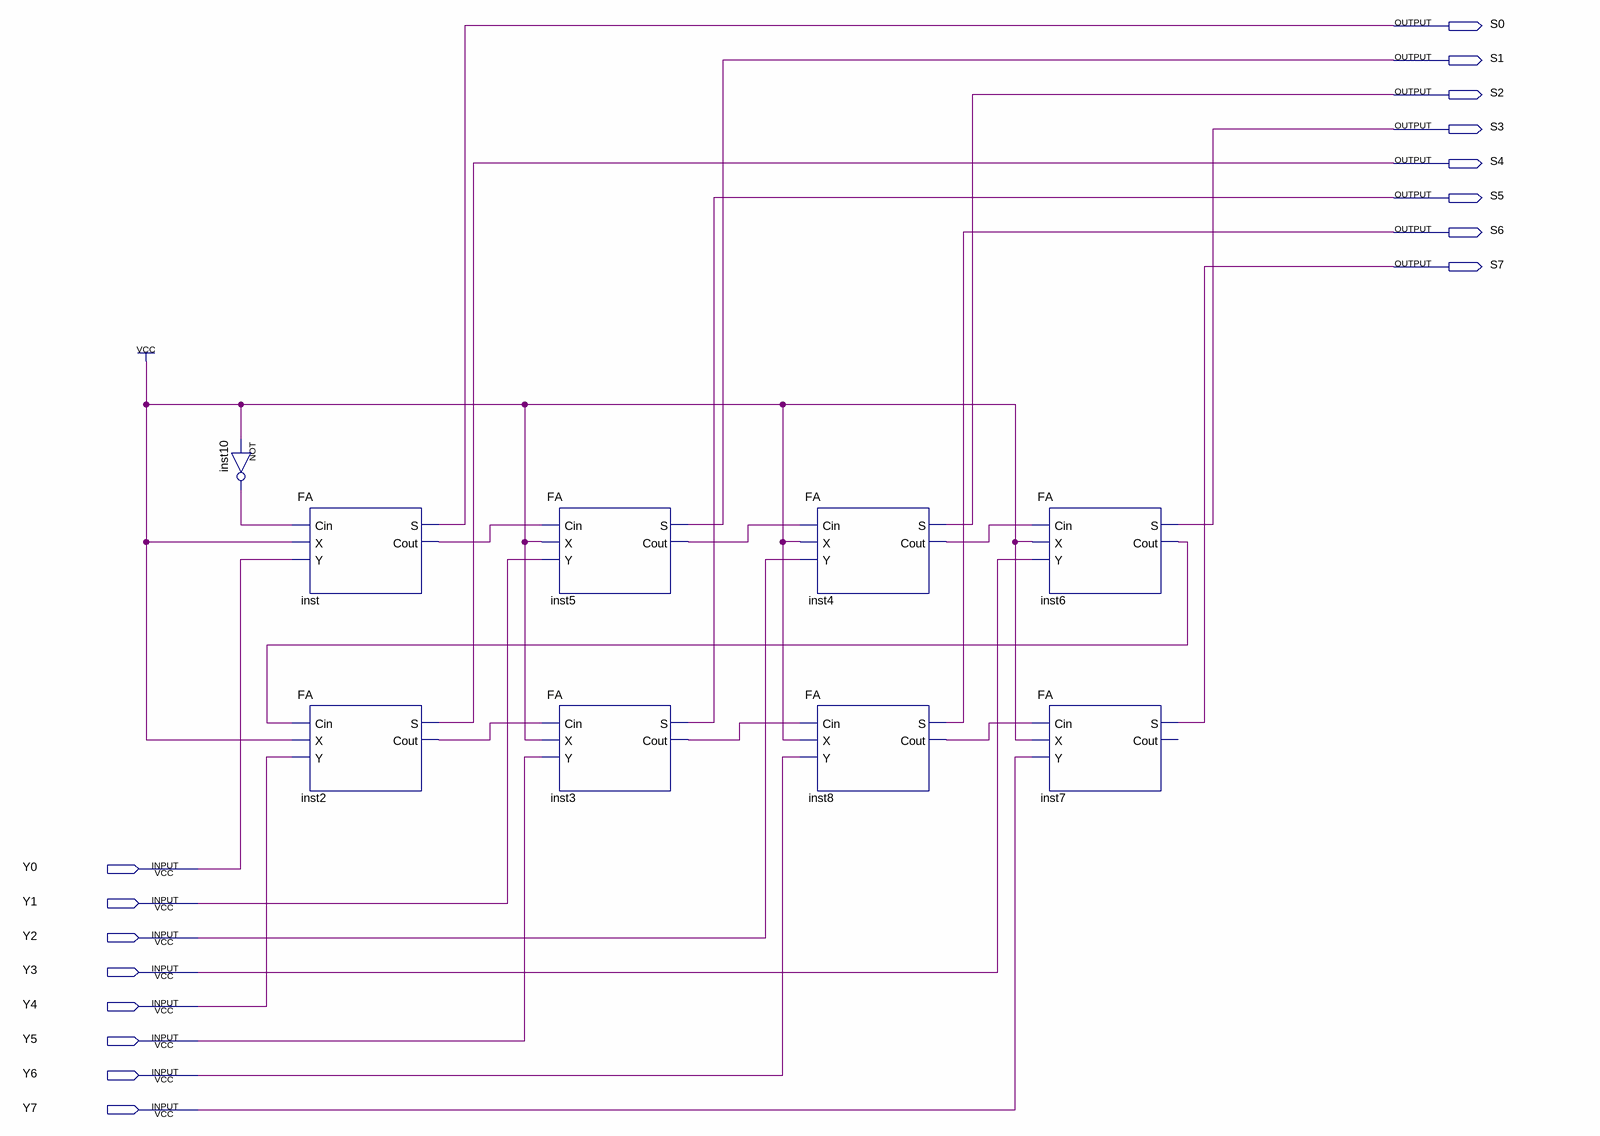
[diagram p0: schematic sheet]
// Quartus schematic Decrementer.bdf as structural Verilog: 9 symbols, 16 pins
module Decrementer (
  input  Y0,
  input  Y1,
  input  Y2,
  input  Y3,
  input  Y4,
  input  Y5,
  input  Y6,
  input  Y7,
  output S0,
  output S1,
  output S2,
  output S3,
  output S4,
  output S5,
  output S6,
  output S7
);

  wire inst2_cout, inst3_cout, inst4_cout, inst5_cout, inst6_cout, inst8_cout, inst10_out, inst_cout;

  not inst10 (inst10_out, 1'b1);
  FA inst (.Cin(inst10_out), .X(1'b1), .Y(Y0), .S(S0), .Cout(inst_cout));
  FA inst2 (.Cin(inst6_cout), .X(1'b1), .Y(Y4), .S(S4), .Cout(inst2_cout));
  FA inst5 (.Cin(inst_cout), .X(1'b1), .Y(Y1), .S(S1), .Cout(inst5_cout));
  FA inst3 (.Cin(inst2_cout), .X(1'b1), .Y(Y5), .S(S5), .Cout(inst3_cout));
  FA inst4 (.Cin(inst5_cout), .X(1'b1), .Y(Y2), .S(S2), .Cout(inst4_cout));
  FA inst8 (.Cin(inst3_cout), .X(1'b1), .Y(Y6), .S(S6), .Cout(inst8_cout));
  FA inst6 (.Cin(inst4_cout), .X(1'b1), .Y(Y3), .S(S3), .Cout(inst6_cout));
  FA inst7 (.Cin(inst8_cout), .X(1'b1), .Y(Y7), .S(S7));  // open: Cout
endmodule
